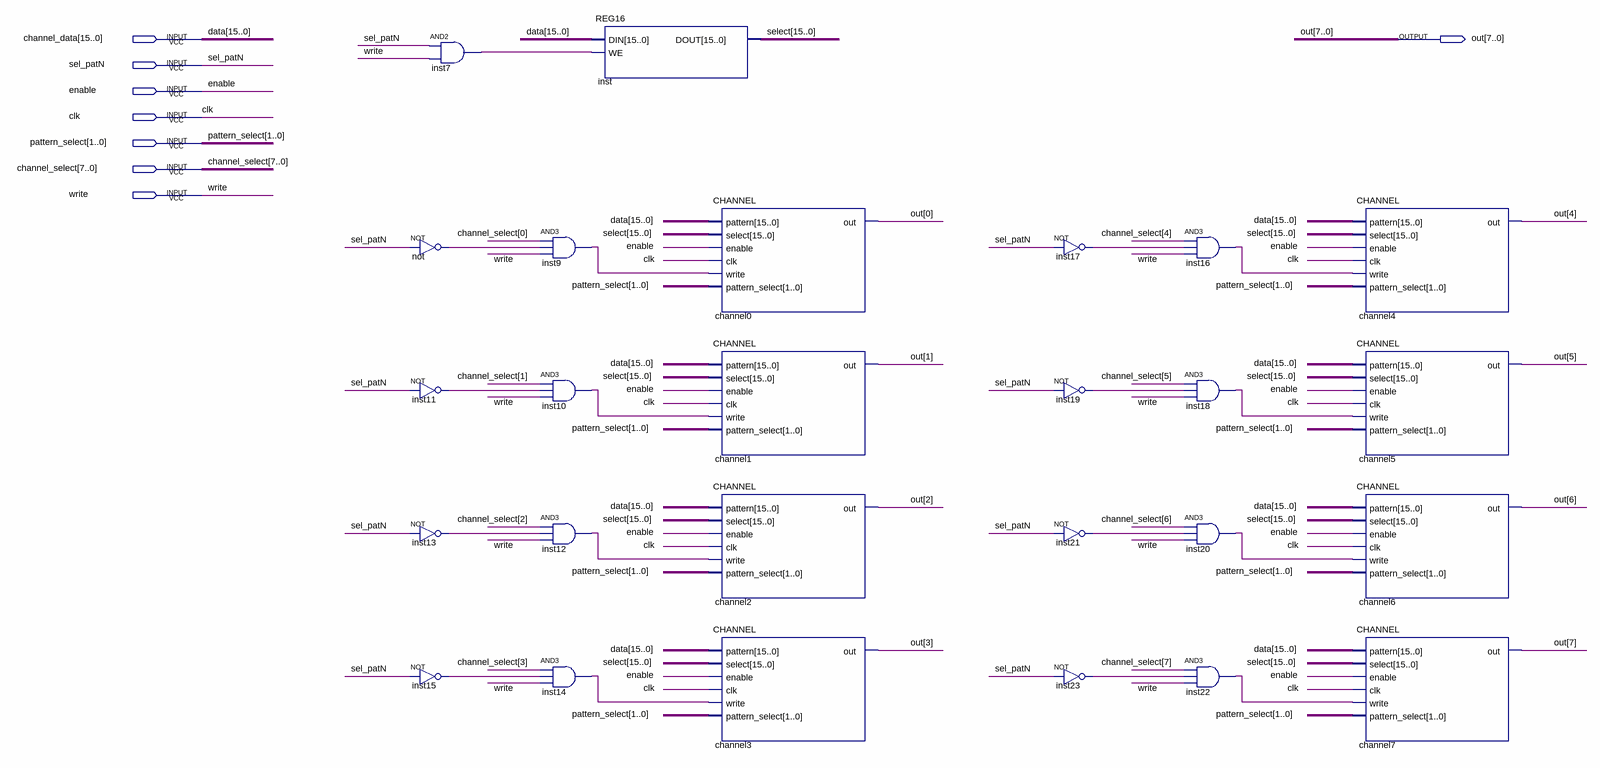
[diagram p0: schematic sheet]
// Quartus schematic CHANNEL_GROUP.bdf as structural Verilog: 26 symbols, 8 pins
module CHANNEL_GROUP (
  input  [15:0] channel_data,
  input  sel_patN,
  input  enable,
  input  clk,
  input  [1:0] pattern_select,
  input  [7:0] channel_select,
  input  write,
  output [7:0] out
);

  wire inst7_out, inst9_out, inst10_out, inst11_out, inst12_out, inst13_out, inst14_out, inst15_out,
       inst16_out, inst17_out, inst18_out, inst19_out, inst20_out, inst21_out, inst22_out, inst23_out,
       not_out;
  wire [15:0] select;

  and inst7 (inst7_out, sel_patN, write);
  not \not  (not_out, sel_patN);
  not inst11 (inst11_out, sel_patN);
  not inst13 (inst13_out, sel_patN);
  not inst15 (inst15_out, sel_patN);
  and inst9 (inst9_out, channel_select[0], not_out, write);
  and inst10 (inst10_out, channel_select[1], inst11_out, write);
  and inst12 (inst12_out, channel_select[2], inst13_out, write);
  and inst14 (inst14_out, channel_select[3], inst15_out, write);
  REG16 inst (.DIN(channel_data), .WE(inst7_out), .DOUT(select));
  CHANNEL channel0 (
    .pattern(channel_data), .select(select), .enable(enable), .clk(clk), .write(inst9_out),
    .pattern_select(pattern_select), .out(out[0]));
  CHANNEL channel1 (
    .pattern(channel_data), .select(select), .enable(enable), .clk(clk), .write(inst10_out),
    .pattern_select(pattern_select), .out(out[1]));
  CHANNEL channel2 (
    .pattern(channel_data), .select(select), .enable(enable), .clk(clk), .write(inst12_out),
    .pattern_select(pattern_select), .out(out[2]));
  CHANNEL channel3 (
    .pattern(channel_data), .select(select), .enable(enable), .clk(clk), .write(inst14_out),
    .pattern_select(pattern_select), .out(out[3]));
  not inst17 (inst17_out, sel_patN);
  not inst19 (inst19_out, sel_patN);
  not inst21 (inst21_out, sel_patN);
  not inst23 (inst23_out, sel_patN);
  and inst16 (inst16_out, channel_select[4], inst17_out, write);
  and inst18 (inst18_out, channel_select[5], inst19_out, write);
  and inst20 (inst20_out, channel_select[6], inst21_out, write);
  and inst22 (inst22_out, channel_select[7], inst23_out, write);
  CHANNEL channel4 (
    .pattern(channel_data), .select(select), .enable(enable), .clk(clk), .write(inst16_out),
    .pattern_select(pattern_select), .out(out[4]));
  CHANNEL channel5 (
    .pattern(channel_data), .select(select), .enable(enable), .clk(clk), .write(inst18_out),
    .pattern_select(pattern_select), .out(out[5]));
  CHANNEL channel6 (
    .pattern(channel_data), .select(select), .enable(enable), .clk(clk), .write(inst20_out),
    .pattern_select(pattern_select), .out(out[6]));
  CHANNEL channel7 (
    .pattern(channel_data), .select(select), .enable(enable), .clk(clk), .write(inst22_out),
    .pattern_select(pattern_select), .out(out[7]));

  // Other names for the same wires on the sheet: data[15:0] = channel_data
endmodule
